# EAGLE design piezoampv10 (EAGLE 6.5.0)
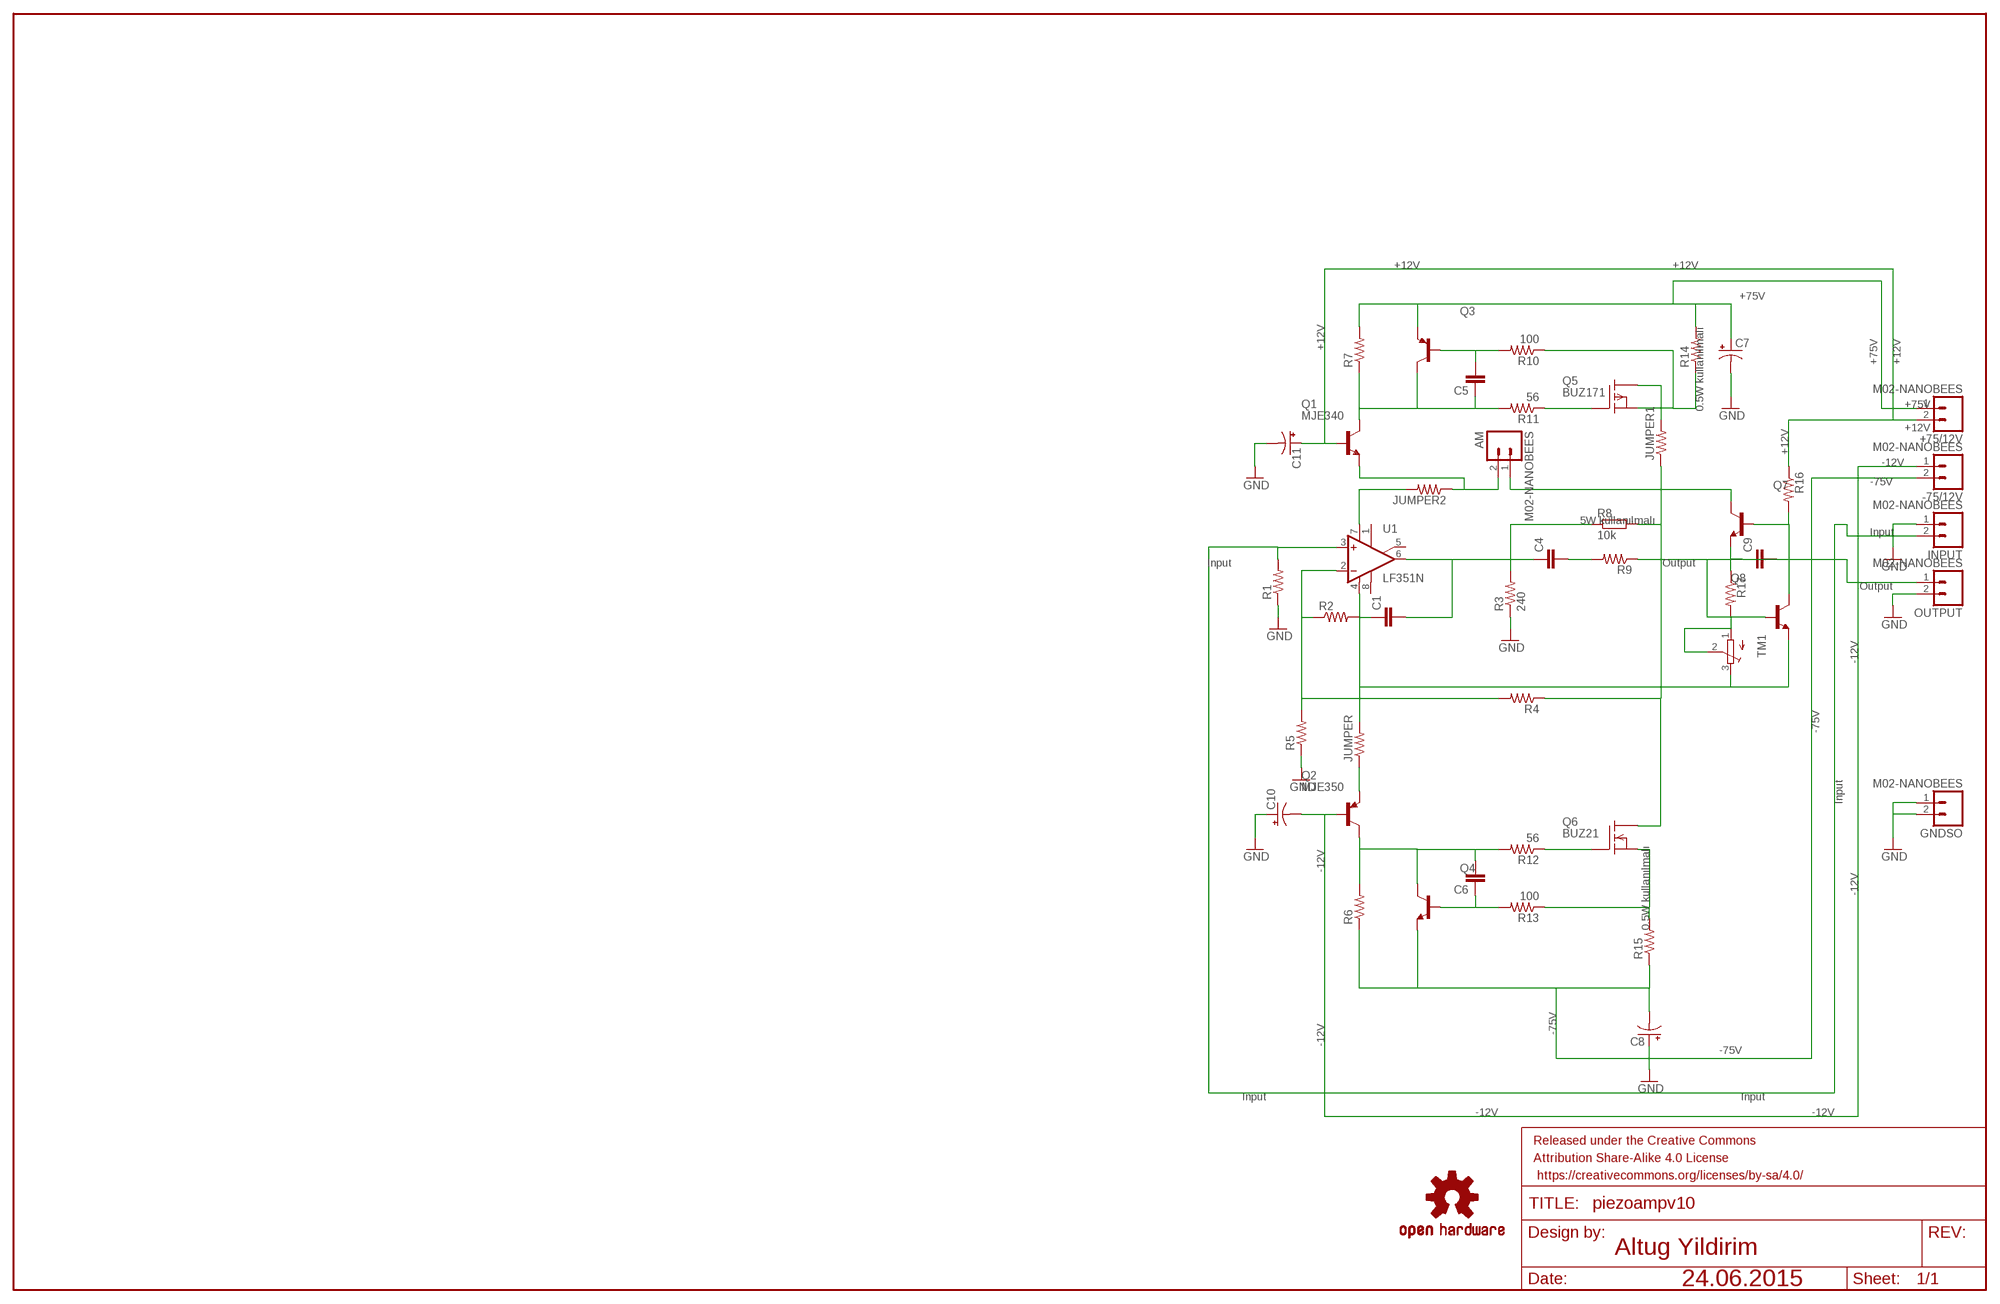
[diagram p0: schematic, sheet 1]

## Parts
+75/12V  M02-NANOBEES  [M02-NANOBEES]
-75/12V  M02-NANOBEES  [M02-NANOBEES]
AM  M02-NANOBEES  [M02-NANOBEES]
C1  CAPPTH2  [CAP-PTH-SMALL2]
C4  CAPPTH2  [CAP-PTH-SMALL2]
C5  CAPPTH2  [CAP-PTH-SMALL2]
C6  CAPPTH2  [CAP-PTH-SMALL2]
C7  CAP_POLPTH3  [CPOL-RADIAL-1000UF-63V]
C8  CAP_POLPTH3  [CPOL-RADIAL-1000UF-63V]
C9  CAPPTH2  [CAP-PTH-SMALL2]
C10  CAP_POLPTH2  [CPOL-RADIAL-10UF-25V]
C11  CAP_POLPTH2  [CPOL-RADIAL-10UF-25V]
FRAME1  FRAME-LEDGER  [CREATIVE_COMMONS]
GNDSO  M02-NANOBEES  [M02-NANOBEES]
INPUT  M02-NANOBEES  [M02-NANOBEES]
JUMPER  R-US_0204/7  [0204/7]
JUMPER1  RESISTORPTH-1/4W  [AXIAL-0.4]
JUMPER2  R-US_0204/7  [0204/7]
LOGO1  OSHW-LOGOM  [OSHW-LOGO-M]
OUTPUT  M02-NANOBEES  [M02-NANOBEES]
Q1  MJE340  [TO126]
Q2  MJE350  [TO126]
Q3  BF421-PNP-TO92-BCE  [TO92-BCE]
Q4  -NPN-TO92-EBC  [TO92-EBC]
Q5  BUZ171  [TO220]
Q6  BUZ21  [TO220]
Q7  -NPN-TO92-EBC  [TO92-EBC]
Q8  -NPN-TO92-EBC  [TO92-EBC]
R1  R-US_0204/7  [0204/7]
R2  R-US_0204/7  [0204/7]
R3  240  R-US_0204/7  [0204/7]
R4  R-US_0204/7  [0204/7]
R5  R-US_0204/7  [0204/7]
R6  R-US_0204/7  [0204/7]
R7  R-US_0204/7  [0204/7]
R8  10k  R-EU_0817/22  [P0817/22]
R9  R-US_0204/7  [0204/7]
R10  100  R-US_0204/7  [0204/7]
R11  56  R-US_0204/7  [0204/7]
R12  56  R-US_0204/7  [0204/7]
R13  100  R-US_0204/7  [0204/7]
R14  RESISTORPTH-1/2W  [AXIAL-0.5]
R15  RESISTORPTH-1/2W  [AXIAL-0.5]
R16  R-US_0204/7  [0204/7]
R17  R-US_0204/7  [0204/7]
TM1  TRIMPOT3386  [TRIM-3386]
U1  LF351N  [DIL08]

## Nets
GND: C7.2(-) C8.1(+) C10.1(+) C11.2(-) GNDSO.1 GNDSO.2 INPUT.1 OUTPUT.2 R1.1 R3.1 R5.1
N$1: INPUT.2 R1.2 U1.3(+IN)
N$2: R2.1 R4.2 R5.2 U1.2(-IN)
N$3: C1.1 R2.2
N$4: C1.2 C4.1 R3.2 R8.1 U1.6(OUT)
N$5: C4.2 R9.2
N$6: JUMPER.1 Q2.1(E)
N$7: JUMPER2.2 U1.7(V+)
N$8: -75/12V.1 C10.2(-) Q2.3(B)
N$9: Q5.1(G) R11.1
N$10: C6.2 Q2.2(C) Q4.C R6.2 R12.2
N$11: Q6.1(G) R12.1
N$12: C6.1 Q4.B R13.2
N$13: Q6.3(S) R13.1 R15.P$2
N$14: -75/12V.2 C8.2(-) Q4.E R6.1 R15.P$1
N$15: C5.1 Q1.2(C) Q3.C R7.1 R11.2
N$16: AM.2 JUMPER2.1 Q1.1(E)
N$17: C5.2 Q3.B R10.2
N$18: R17.2 TM1.1(A) TM1.2(S)
N$19: Q5.3(S) R10.1 R14.P$1
N$22: +75/12V.1 C7.1(+) Q3.E R7.2 R14.P$2
N$24: C9.1 Q7.E Q8.B R17.1
N$26: C9.2 Q7.B Q8.C R16.2
N$27: JUMPER1.P$2 Q5.2(D)
N$28: OUTPUT.1 R9.1
N$29: JUMPER1.P$1 Q6.2(D) R4.1 R8.2
N$32: +75/12V.2 C11.1(+) Q1.3(B) R16.1
N$33: JUMPER.2 Q8.E TM1.3(E) U1.4(V-)
N$34: AM.1 Q7.C
Unconnected: U1.1(ON1) U1.5(ON2) U1.8(OPT)

## Notes on the sheet
- +12V | +12V
- +75V
- 0.5W kullanılmalı
- +75V | +12V
- +12V
- +75V
- +12V
- +12V
- -12V
- -75V
- 5W kullanılmalı
- Input
- Input | Output
- Output
- -12V
- -75V
- Input
- -12V
- -12V
- 0.5W kullanılmalı
- -75V
- -12V | -75V
- Input | Input
- -12V | -12V
- Altug Yildirim
- 24.06.2015

## Library data of the parts
+75/12V -75/12V AM GNDSO INPUT OUTPUT = SparkFun-Connectors:M02-NANOBEES
C1 C4-C6 C9 = SparkFun-Capacitors:CAP: Capacitor Standard 0603 ceramic capacitor, and 0.1" leaded capacitor.
C7 C8 C10 C11 = SparkFun-Capacitors:CAP_POL: Capacitor Polarized These are standard SMD and PTH capacitors. Normally 10uF, 47uF, and 100uF in electrolytic and tantalum varieties. Always verify the external diameter of the through hole cap, it varies with capacity, voltage, and manufacturer. The EIA devices should be standard.
FRAME1 = SparkFun-Aesthetics:FRAME-LEDGER: Schematic Frame Standard 11x14 US Ledger frame
JUMPER JUMPER2 R1-R7 R9-R13 R16 R17 = resistor:R-US_: RESISTOR, American symbol
JUMPER1 R14 R15 = SparkFun-Resistors:RESISTOR: Resistor Basic schematic elements and footprints for 0603, 1206, and PTH resistors.
LOGO1 = SparkFun-Aesthetics:OSHW-LOGO: Open Source Hardware Logo This logo indicates the piece of hardware it is found on incorporates a OSHW license and/or adheres to the definition of open source hardware found here: http://freedomdefined.org/OSHW
Q1 = transistor_nanobees:MJE340: NPN TRANSISTOR
Q2 = transistor-pnp_nanobees:MJE350: PNP Transistor
Q3 = transistor:*-PNP-: PNP Transistror
Q4 Q7 Q8 = transistor:*-NPN-: NPN Transistror BF959 corrected 2008.03.06
Q5 = transistor-fet_nanobees:BUZ171: P-Channel Enhancement MOSFET -50V; 7A; 0,4Ohm
Q6 = transistor-fet_nanobees:BUZ21: N-Channel Enhancement MOSFET 100V; 19A; 0,1Ohm
R8 = resistor:R-EU_: RESISTOR, European symbol
TM1 = adafruit:TRIMPOT: SMT trimmer potentiometer part number TC33X http://www.ladyada.net/library/eagle
U1 = linear:LF351: OP AMP

## Board
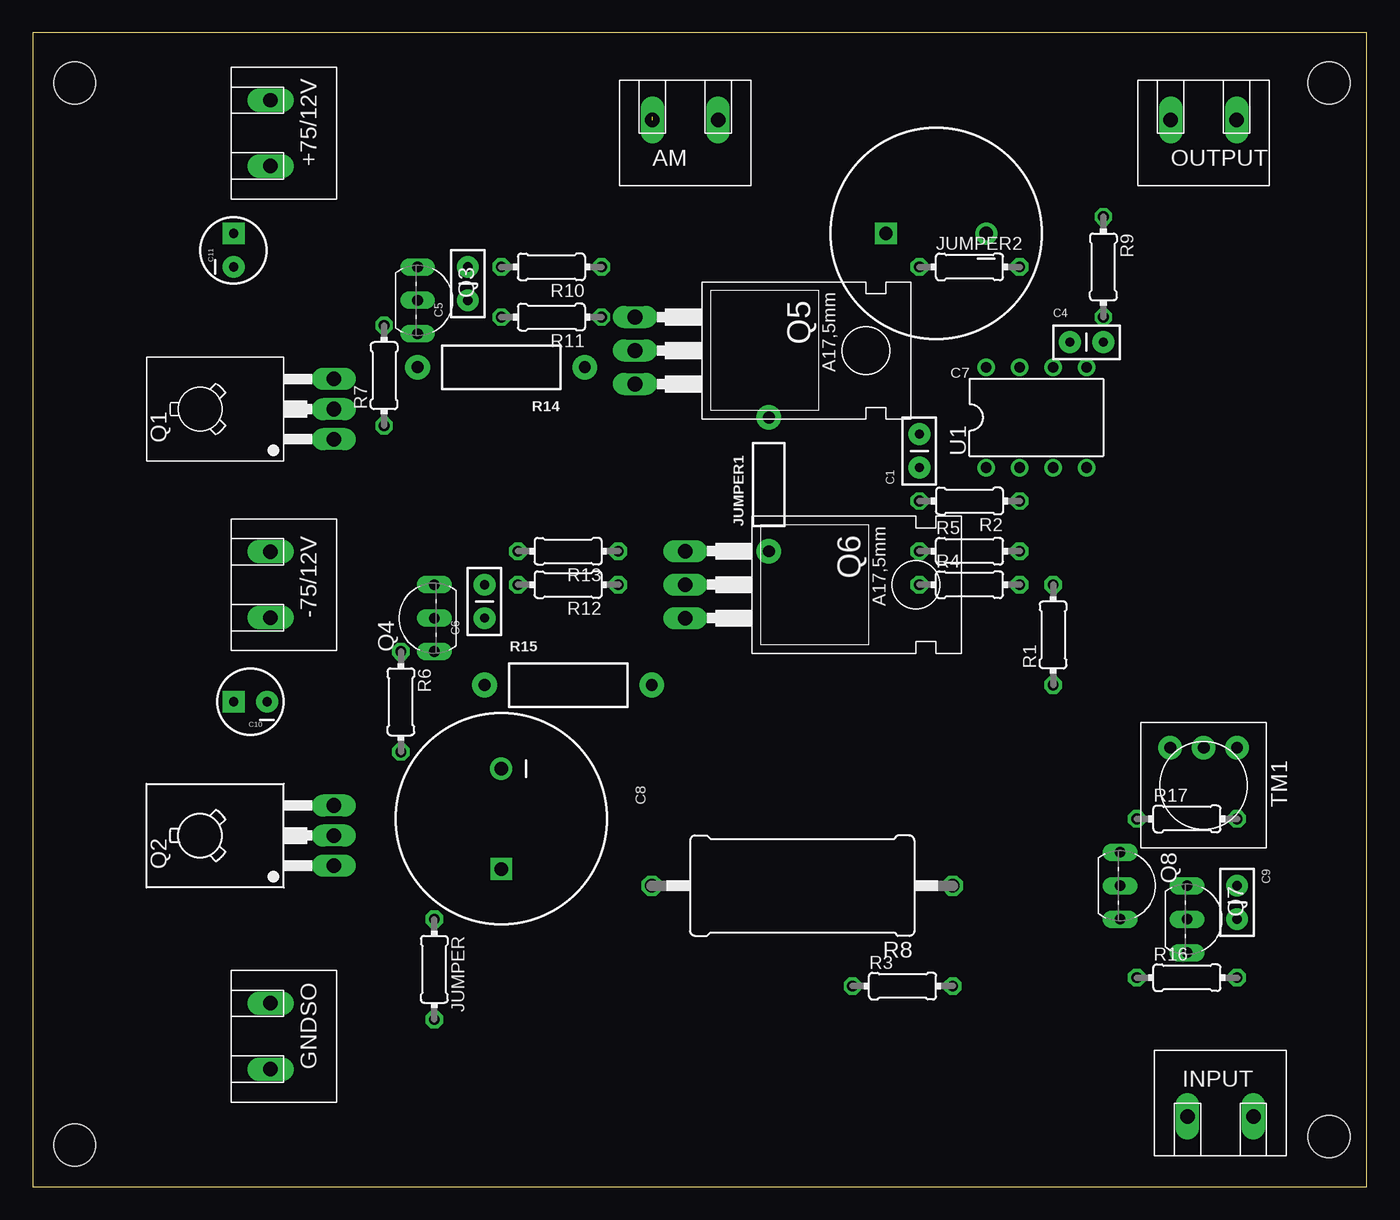
[diagram p1: board, top side]
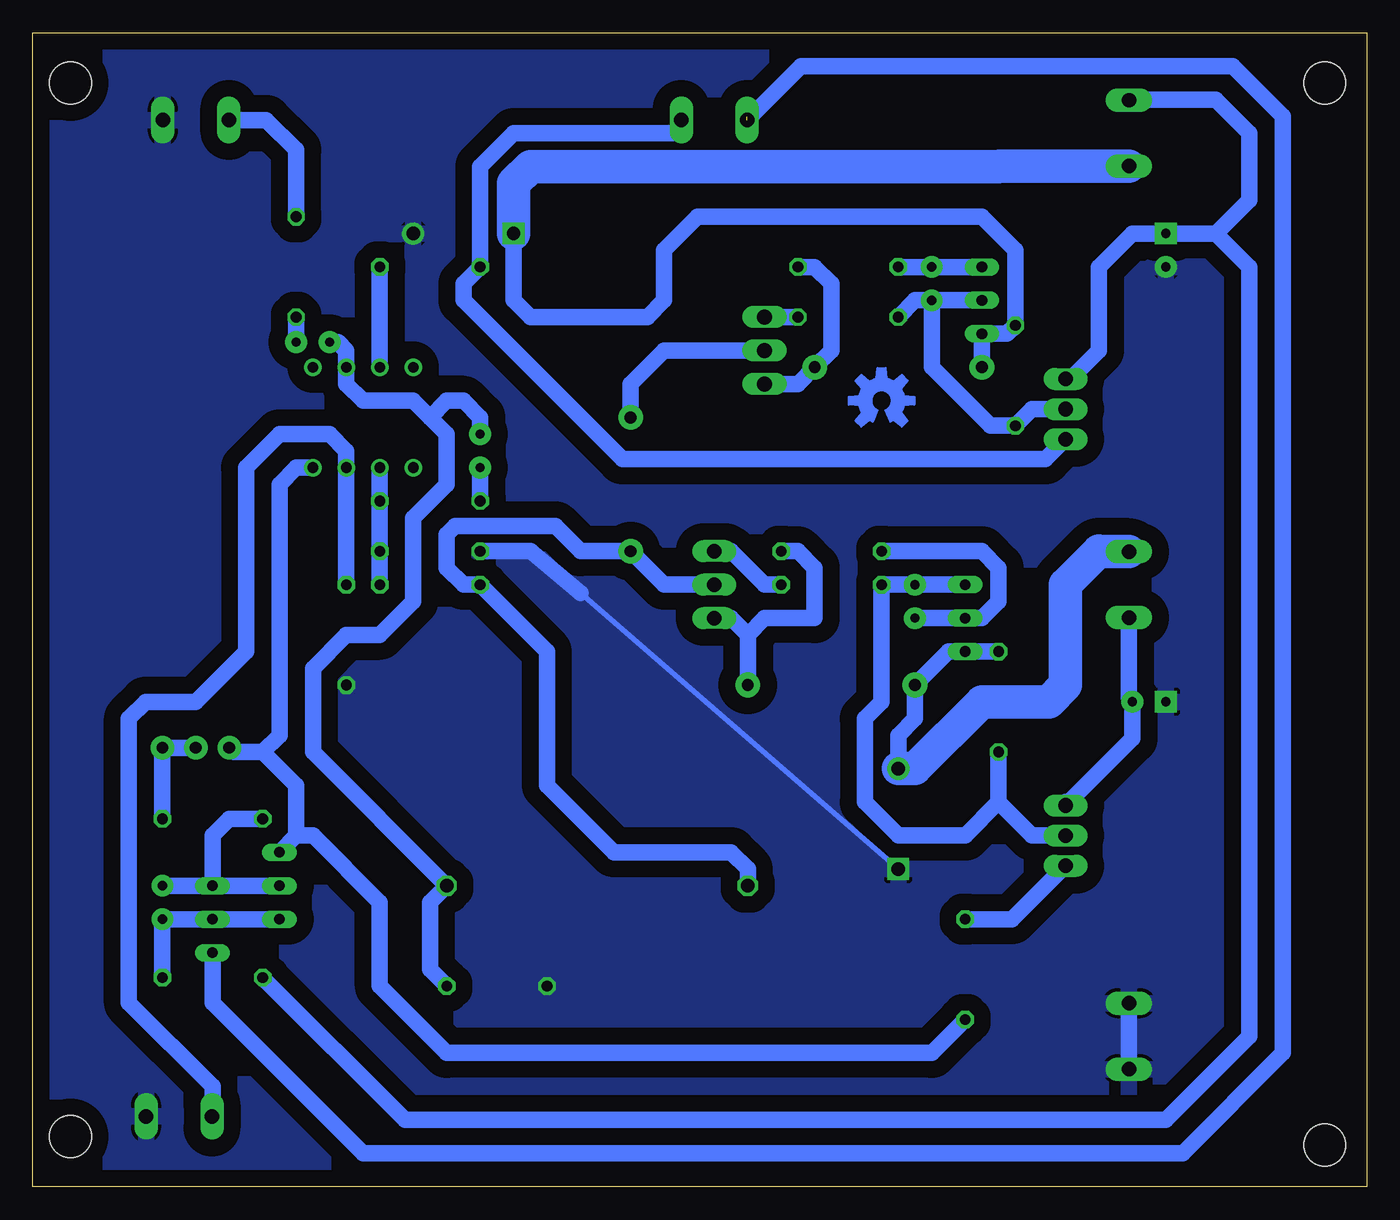
[diagram p2: board, bottom side, seen from below]

Size 101.27 x 87.62 mm. Coordinates in mm from the lower left corner, seen from the top.
Outline: 0,0 101.27,0 101.27,87.62 0,87.62 0,0
Copper layers (1*16): Top 0.035mm / dielectric 1.5mm / Bottom 0.035mm
Design rules "default": minimum track width 10mil, minimum drill 24mil, track to track 8mil, track to pad 8mil, pad to pad 8mil, via to via 8mil, smd to smd 8mil, copper to edge 40mil, drill to drill 8mil, minimum pad ring 10mil, minimum via ring 8mil, stop-mask expansion 4mil, vias tented up to drill 0mil, thermal gap 10mil
Holes 3.2 mm at 3.17,83.82 3.17,3.17 98.43,3.81 98.43,83.82

### Footprints (pad centres in the part's own frame; a part is rotated, then mirrored left to right if it is on the bottom)
M02-NANOBEES = drill 1.1 pad 1.778 long: 1 -2.5,1; 2 2.5,1
CAP-PTH-SMALL2 = drill 0.7 pad 1.651: 1 0,0; 2 2.54,0
CPOL-RADIAL-1000UF-63V = drill 1.016 pad 1.651 square: 1 3.81,0 | drill 1.016 pad 1.676: 2 -3.81,0
CPOL-RADIAL-10UF-25V = drill 0.7 pad 1.651 square: 1 1.27,0 | drill 0.7 pad 1.651: 2 -1.27,0
0204/7 = drill 0.813 octagon: 1 -3.81,0; 2 3.81,0
AXIAL-0.4 = drill 0.9 pad 1.88: P$1 -5.08,0; P$2 5.08,0
TO126 = drill 1.118 long: 1 -2.286,-5.08; 2 0,-5.08; 3 2.286,-5.08
TO92-BCE = drill 0.813 long: B -2.54,0; C 0,0; E 2.54,0
TO92-EBC = drill 0.813 long: B 0,-1.27; C 2.54,-1.27; E -2.54,-1.27
TO220 = drill 1.118 long: 1 -2.54,-6.35; 2 0,-6.35; 3 2.54,-6.35
P0817/22 = drill 1.016 octagon: 1 -11.43,0; 2 11.43,0
AXIAL-0.5 = drill 0.9 pad 1.88: P$1 -6.35,0; P$2 6.35,0
TRIM-3386 = drill 0.9 pad 1.778: 1 -2.54,-2.857; 2 0,-2.857; 3 2.54,-2.857
DIL08 = drill 0.813 pad 1.27: 1 -3.81,-3.81; 2 -1.27,-3.81; 3 1.27,-3.81; 4 3.81,-3.81; 5 3.81,3.81; 6 1.27,3.81; 7 -1.27,3.81; 8 -3.81,3.81

### Placement (x,y rotation side)
+75/12V  19.05,80.01 90 top
-75/12V  19.05,45.72 90 top
AM  49.53,80.01 0 top
C1  67.31,54.61 90 top
C4  78.74,64.14 0 top
C5  33.02,67.31 90 top
C6  34.29,43.18 90 top
C7  68.58,72.39 180 top
C8  35.56,27.94 270 top
C9  91.44,22.86 270 top
C10  16.51,36.83 180 top
C11  15.24,71.12 90 top
FRAME1  26.67,-5.08 0 top  (outside the outline)
GNDSO  19.05,11.43 90 top
INPUT  90.17,6.35 180 top
JUMPER  30.48,16.51 270 top
JUMPER1  55.88,53.34 90 top
JUMPER2  71.12,69.85 0 top
LOGO1  36.83,59.69 0 top
OUTPUT  88.9,80.01 0 top
Q1  17.78,59.05 90 top
Q2  17.78,26.67 90 top
Q3  29.21,67.31 270 top
Q4  29.21,43.18 90 top
Q5  52.07,63.5 270 top
Q6  55.88,45.72 270 top
Q7  88.9,20.32 270 top
Q8  83.82,22.86 270 top
R1  77.47,41.91 90 top
R2  71.12,52.07 180 top
R3  66.04,15.24 0 top
R4  71.12,45.72 0 top
R5  71.12,48.26 0 top
R6  27.94,36.83 270 top
R7  26.67,61.59 90 top
R8  58.42,22.86 180 top
R9  81.28,69.85 270 top
R10  39.37,69.85 180 top
R11  39.37,66.04 180 top
R12  40.64,45.72 180 top
R13  40.64,48.26 180 top
R14  35.56,62.23 180 top
R15  40.64,38.1 0 top
R16  87.63,15.88 0 top
R17  87.63,27.94 0 top
TM1  88.9,30.48 180 top
U1  76.2,58.42 0 top

### Tracks (layer width: path | path; a pad name or v marks a point on that pad's centre or on a via)
GND
  Bottom 0.406: 59.69,45.09 C8.1
  Bottom 1.27: GNDSO.1 GNDSO.2 | R5.1 63.5,48.26 59.69,45.09
  pour Bottom (isolate 1.27): 0,87.63 0,0 101.6,0 101.6,87.63
N$1
  Bottom 1.27: R1.2 U1.3 77.47,55.88 78.74,57.15 82.55,57.15 85.09,54.61 85.09,40.64 88.9,36.83 92.71,36.83 93.98,35.56 93.98,13.97 87.63,7.62 87.63,5.39 INPUT.2
N$2
  Bottom 1.27: U1.2 R2.1 R5.2 R4.2
N$3
  Bottom 1.27: C1.1 R2.2
N$4
  Bottom 1.27: R3.2 71.12,16.51 71.12,21.59 R8.1 80.01,33.02 80.01,39.37 77.47,41.91 74.93,41.91 72.39,44.45 72.39,50.8 69.85,53.34 69.85,57.15 71.12,58.42 | 71.12,58.42 72.39,59.69 76.2,59.69 77.47,60.96 U1.6 77.47,63.5 78.1,64.14 C4.1 | C1.2 67.31,58.42 68.58,59.69 69.85,59.69 71.12,58.42
N$5
  Bottom 1.27: R9.2 C4.2
N$6
  Bottom 1.27: Q2.1 26.92,20.32 JUMPER.1
N$7
  Bottom 1.27: JUMPER2.2 U1.7
N$8
  Bottom 1.27: 22.86,29.21 Q2.3 17.78,34.04 C10.2 18.05,37.1 -75/12V.1
N$9
  Bottom 1.27: Q5.1 R11.1
N$10
  Bottom 1.27: Q2.2 25.4,26.67 27.94,29.21 | 27.94,29.21 R6.2 | 27.94,29.21 30.48,26.67 35.56,26.67 38.1,29.21 38.1,35.56 36.83,36.83 R12.2 C6.2 Q4.C
N$11
  Bottom 1.27: Q6.1 48.26,48.26 45.72,45.72 R12.1
N$12
  Bottom 1.27: R13.2 29.21,48.26 27.94,46.99 27.94,44.45 29.21,43.18 Q4.B C6.1
N$13
  Bottom 1.27: R13.1 43.18,48.26 41.91,46.99 41.91,43.18 45.72,43.18 46.99,41.91 | 46.99,41.91 R15.P$2 | Q6.3 48.26,43.18 46.99,41.91
N$14
  Bottom 1.27: C8.2 35.56,34.29 34.29,35.56 R15.P$1 31.75,40.64 Q4.E R6.1
  Bottom 2.54: C8.2 34.29,31.75 29.21,36.83 24.13,36.83 22.86,38.1 22.86,40.64 22.86,41.91 22.86,45.72 20.32,48.26 20.28,48.22 -75/12V.2
N$15
  Bottom 1.27: C5.1 33.02,62.23 28.57,57.78 R7.1 25.4,59.05 Q1.2 | Q3.C C5.1 | R11.2 34.29,67.31 C5.1
N$16
  Bottom 1.27: AM.2 52.03,80.69 52.7,80.01 64.77,80.01 67.31,77.47 JUMPER2.1 68.58,68.58 68.58,67.31 56.52,55.24 24.38,55.24 Q1.1
N$17
  Bottom 1.27: Q3.B C5.2 R10.2
N$18
  Bottom 1.27: TM1.2 TM1.1 R17.2
N$19
  Bottom 1.27: Q5.3 43.18,60.96 R14.P$1 40.64,63.5 40.64,68.58 41.91,69.85 R10.1
N$22
  Bottom 1.27: C7.1 64.77,67.31 63.5,66.04 54.61,66.04 53.34,67.31 53.34,71.12 50.8,73.66 29.21,73.66 26.67,71.12 R7.2 27.3,64.77 Q3.E R14.P$2
  Bottom 2.54: C7.1 64.77,76.2 63.5,77.47 27.94,77.47 27.9,77.51 +75/12V.1
N$24
  Bottom 1.27: Q7.E 87.63,26.67 86.36,27.94 R17.1 | Q8.B Q7.E | Q7.E C9.1
N$26
  Bottom 1.27: Q8.C Q7.B C9.2 R16.2
N$27
  Bottom 1.27: Q5.2 53.34,63.5 55.88,60.96 JUMPER1.P$2
N$28
  Bottom 1.27: R9.1 81.28,78.74 83.55,81.01 OUTPUT.1
N$29
  Bottom 1.27: R8.2 46.99,24.13 48.26,25.4 57.15,25.4 62.23,30.48 62.23,40.64 R4.1 68.58,45.72 69.85,46.99 69.85,49.53 69.22,50.16 61.59,50.16 59.69,48.26 JUMPER1.P$1 53.34,45.72 Q6.2
N$32
  Bottom 1.27: R16.1 73.03,5.08 15.24,5.08 8.89,11.43 8.89,69.85 11.43,72.39 | +75/12V.2 18.01,82.55 11.43,82.55 8.89,80.01 8.89,74.93 11.43,72.39 | 11.43,72.39 C11.1 17.78,72.39 20.32,69.85 20.32,63.5 22.48,61.34 Q1.3
N$33
  Bottom 1.27: JUMPER.2 33.02,10.16 69.85,10.16 74.93,15.24 74.93,21.59 80.01,26.67 81.28,26.67 | U1.4 81.28,54.61 82.55,53.34 82.55,34.29 83.82,33.02 | 81.28,26.67 Q8.E | 81.28,26.67 81.28,30.48 83.82,33.02 | 83.82,33.02 86.04,33.02 TM1.3
N$34  (1 unrouted)
  Bottom 1.27: Q7.C 87.63,13.97 76.2,2.54 13.97,2.54 6.35,10.16 6.35,81.28 10.16,85.09 42.95,85.09 AM.1 | 47.03,81.24 46.99,81.28